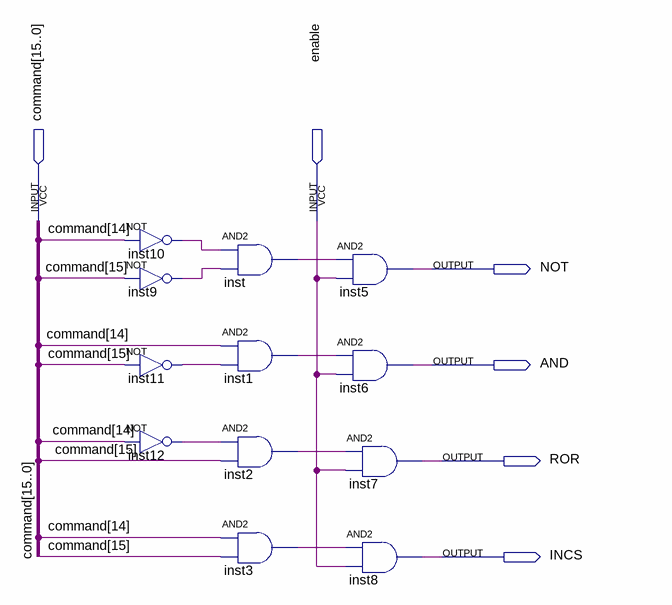
[diagram p0: schematic sheet]
// Quartus schematic ALU_DECODER.bdf as structural Verilog: 12 symbols, 6 pins
module ALU_DECODER (
  input  [15:0] command,
  input  enable,
  output NOT,
  output AND,
  output ROR,
  output INCS
);

  wire inst1_out, inst2_out, inst3_out, inst9_out, inst10_out, inst11_out, inst12_out, inst_out;

  not inst10 (inst10_out, command[14]);
  not inst9 (inst9_out, command[15]);
  not inst11 (inst11_out, command[15]);
  not inst12 (inst12_out, command[14]);
  and inst (inst_out, inst10_out, inst9_out);
  and inst1 (inst1_out, command[14], inst11_out);
  and inst2 (inst2_out, inst12_out, command[15]);
  and inst3 (inst3_out, command[14], command[15]);
  and inst5 (NOT, inst_out, enable);
  and inst6 (AND, inst1_out, enable);
  and inst7 (ROR, inst2_out, enable);
  and inst8 (INCS, inst3_out, enable);
endmodule
